# EAGLE design Gameboy-Link-Clock (EAGLE 9.5.2)
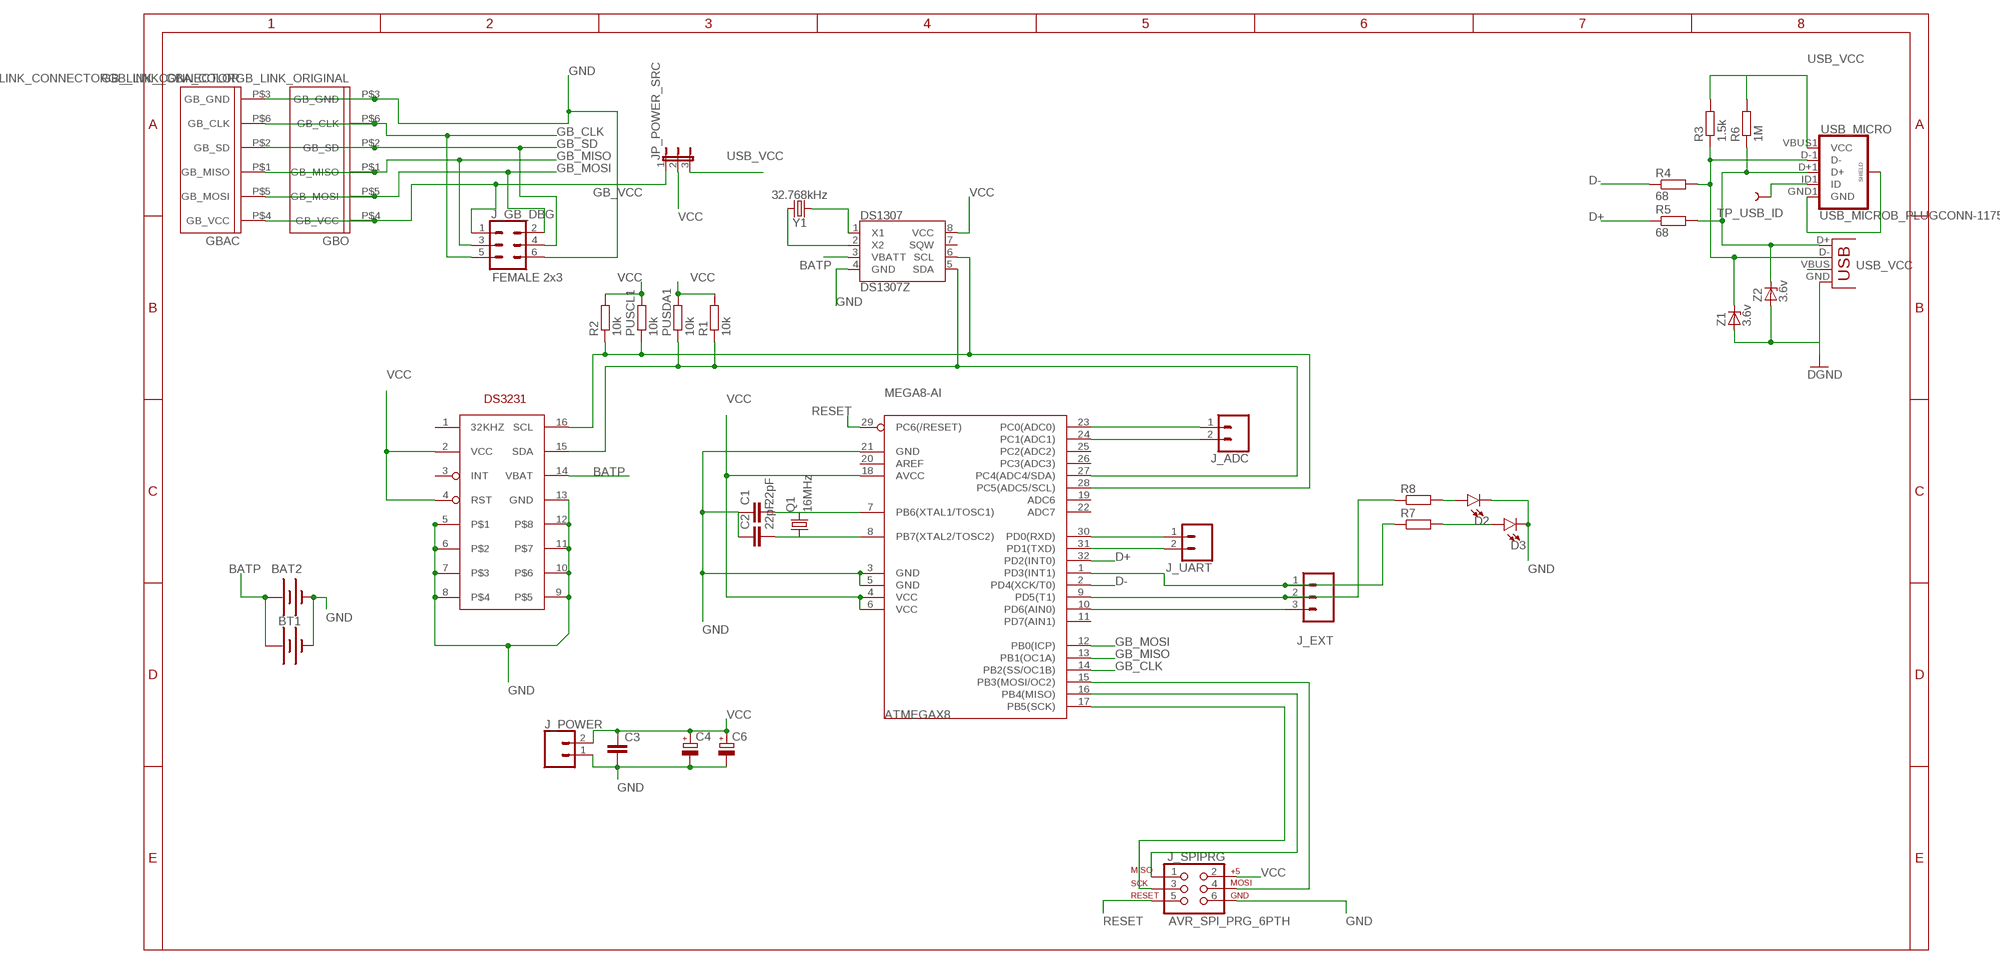
[diagram p0: schematic, sheet 1]

## Parts
ATMEGAX8  MEGA8-AI  [TQFP32-08]
BAT2  BATTERY-20MM_PTH  [BATTCOM_20MM_PTH]
BT1  BATTERY-20MM_SMD  [BATTCON_20MM]
C1  22pF  C-EU025-024X044  [C025-024X044]
C2  22pF  C-EU025-024X044  [C025-024X044]
C3  C-EU025-024X044  [C025-024X044]
C4  CPOL-EUE2,5-6E  [E2,5-6E]
C6  CPOL-EU150CLZ-1014  [150CLZ-1014]
D2  LED1206  [LED-1206]
D3  LED1206  [LED-1206]
DS1307  DS1307Z  [SO08-0.15]
DS3231  DS3231DS3231-SO16W  [SO16W]
GBAC  GB_LINK_CONNECTORGB_LINK_GBA_COLOR  [GB_LINK_CONNECTOR_COLOR]
GBO  GB_LINK_CONNECTORGB_LINK_ORIGINAL  [GB_LINK_CONNECTOR_CLASSIC]
J_ADC  CONN_02  [1X02]
J_EXT  455-1750-1-ND  CONN_03  [1X03]
J_GB_DBG  FEMALE 2x3  CONN_03X2FEMALE  [2X3]
J_POWER  CONN_02  [1X02]
J_SPIPRG  AVR_SPI_PRG_6PTH  [2X3]
J_UART  CONN_02  [1X02]
JP_POWER_SRC  JP2E  [JP2]
PUSCL1  10k  R-EU_0207/2V  [0207/2V]
PUSDA1  10k  R-EU_0207/2V  [0207/2V]
Q1  16MHz  CRYSTALHC49S  [HC49/S]
R1  10k  R-EU_R1206  [R1206]
R2  10k  R-EU_R1206  [R1206]
R3  1.5k  R-EU_0204/2V  [0204V]
R4  68  R-EU_0204/2V  [0204V]
R5  68  R-EU_0204/2V  [0204V]
R6  1M  R-EU_0204/2V  [0204V]
R7  R-EU_R1206  [R1206]
R8  R-EU_R1206  [R1206]
TP_USB_ID  TEST-POINT3X5  [PAD.03X.05]
USB_MICRO  USB_MICROB_PLUGCONN-11752  [USB-B-MICRO-SMD_V03]
USB_MINI  USBSMD  [USB-MINIB]
Y1  32.768kHz  CRYSTAL-32.768KHZPTH-2X6  [CRYSTAL-PTH-2X6-CYL]
Z1  3.6v  ZENER-DIODEZD-2.5  [ZDIO-2.5]
Z2  3.6v  ZENER-DIODEZD-2.5  [ZDIO-2.5]

## Nets
BATP: BAT2.1(+) BT1.1(+) DS1307.3(VBATT) DS3231.14(VBAT)
D+: ATMEGAX8.32(PD2(INT0)) R5.1
D-: ATMEGAX8.2(PD4(XCK/T0)) R4.1
GB_CLK: ATMEGAX8.14(PB2(SS/OC1B)) GBAC.P$6(GB_CLK) GBO.P$6(GB_CLK) J_GB_DBG.5
GB_MISO: ATMEGAX8.13(PB1(OC1A)) GBAC.P$1(GB_MISO) GBO.P$1(GB_MISO) J_GB_DBG.3
GB_MOSI: ATMEGAX8.12(PB0(ICP)) GBAC.P$5(GB_MOSI) GBO.P$5(GB_MOSI) J_GB_DBG.2
GB_SD: GBAC.P$2(GB_SD) GBO.P$2(GB_SD) J_GB_DBG.4
GB_VCC: GBAC.P$4(GB_VCC) GBO.P$4(GB_VCC) J_GB_DBG.1 JP_POWER_SRC.1
GND: ATMEGAX8.3(GND) ATMEGAX8.5(GND) ATMEGAX8.21(GND) BAT2.2(-) BT1.2(-) C1.1 C2.1 C3.2 C4.- C6.- D2.C D3.C DS1307.4(GND) DS3231.5 DS3231.6 DS3231.7 DS3231.8 DS3231.9 DS3231.10 DS3231.11 DS3231.12 DS3231.13(GND) GBAC.P$3(GB_GND) GBO.P$3(GB_GND) J_GB_DBG.6 J_POWER.1 J_SPIPRG.6 USB_MICRO.GND1(GND) USB_MICRO.SHIELD1(SHIELD) USB_MICRO.SHIELD2(SHIELD) USB_MICRO.SHIELD3(SHIELD) USB_MINI.GND Z1.A Z2.A ; supply symbol labelled DGND
N$1: ATMEGAX8.28(PC5(ADC5/SCL)) DS1307.6(SCL) DS3231.16(SCL) PUSCL1.1 R2.1
N$2: ATMEGAX8.27(PC4(ADC4/SDA)) DS1307.5(SDA) DS3231.15(SDA) PUSDA1.1 R1.1
N$3: ATMEGAX8.17(PB5(SCK)) J_SPIPRG.3
N$4: ATMEGAX8.7(PB6(XTAL1/TOSC1)) C1.2 Q1.2
N$5: ATMEGAX8.8(PB7(XTAL2/TOSC2)) C2.2 Q1.1
N$7: ATMEGAX8.15(PB3(MOSI/OC2)) J_SPIPRG.4
N$8: ATMEGAX8.16(PB4(MISO)) J_SPIPRG.1
N$9: ATMEGAX8.1(PD3(INT1)) J_EXT.1 R7.1
N$11: ATMEGAX8.10(PD6(AIN0)) J_EXT.3
N$12: ATMEGAX8.30(PD0(RXD)) J_UART.1
N$13: ATMEGAX8.31(PD1(TXD)) J_UART.2
N$14: TP_USB_ID.1 USB_MICRO.ID1(ID)
N$15: ATMEGAX8.24(PC1(ADC1)) J_ADC.2
N$17: ATMEGAX8.9(PD5(T1)) J_EXT.2 R8.1
N$18: ATMEGAX8.23(PC0(ADC0)) J_ADC.1
N$19: D2.A R8.2
N$20: D3.A R7.2
N$23: DS1307.1(X1) Y1.1
N$24: DS1307.2(X2) Y1.2
RESET: ATMEGAX8.29(PC6(/RESET)) J_SPIPRG.5
USB_VCC: JP_POWER_SRC.3 R3.2 R6.2 USB_MICRO.VBUS1(VCC) USB_MINI.VBUS
USBD+: R5.2 R6.1 USB_MICRO.D+1(D+) USB_MINI.D+ Z2.C
USBD-: R3.1 R4.2 USB_MICRO.D-1(D-) USB_MINI.D- Z1.C
VCC: ATMEGAX8.4(VCC) ATMEGAX8.6(VCC) ATMEGAX8.18(AVCC) C3.1 C4.+ C6.+ DS1307.8(VCC) DS3231.2(VCC) DS3231.4(RST) J_POWER.2 J_SPIPRG.2 JP_POWER_SRC.2 PUSCL1.2 PUSDA1.2 R1.2 R2.2
Unconnected: ATMEGAX8.11(PD7(AIN1)) ATMEGAX8.19(ADC6) ATMEGAX8.20(AREF) ATMEGAX8.22(ADC7) ATMEGAX8.25(PC2(ADC2)) ATMEGAX8.26(PC3(ADC3)) DS1307.7(SQW) DS3231.1(32KHZ) DS3231.3(INT)

## Library data of the parts
ATMEGAX8 = atmel:MEGA8: MICROCONTROLLER 8 Kbytes FLASH, 1 kbytes SRAM, 512 bytes EEPROM, USART, 6-channel 10 bit ADC, 2-channel 8 bit ADC Pin compatible with Atmega48, ATMega88, ATMega168 Source: avr.lbr; MPN: ATMEGA8-16AU; OC_FARNELL: 9171371; OC_NEWARK: 73M8863
BAT2 = SparkFun-Batteries:BATTERY: Battery - Single Cell A variety of battery chemistries, sizes, and footprints. Device List: 20MM_PTH - Coin Cell Battery Holder - 20mm (PTH) <https://www.sparkfun.com/products/783> 20MM_PTH_KIT- Coin Cell battery Holder - 20 mm (PTH) <http://www.sparkfun.com/products/783>kit version with special mask 6.8MM_PTH - Coin Cell Battery Holder - 6.8MM(SMD) <https://www.digikey.com/product-detail/en/seiko-instruments/MS621FE-FL11E/728-1057-ND/1889208?WT.srch=1&gclid=CNOQ5a6LzdQCFZS2wAodXCkE0g> 12MM_SMD - Coin Cell Battery Holder - 12mm (SMD) <https://www.sparkfun.com/products/10592> 12MM_PTH - Coin Cell Battery Holder - 12mm (PTH) <https://www.sparkfun.com/products/7948> 20MM_SMD - 20mm Coin Cell Battery Holder (SMD) (2 legs) Used on the Big Time Watch Kit <https://www.sparkfun.com/products/11734> 20MM_SMD_4LEGS - Coin Cell Battery Holder - 20mm (SMD) <https://www.sparkfun.com/products/11892> 20MM_SMD_4LEGS_OVERPASTE - Coin Cell Battery Holder - 20mm (SMD) <https://www.sparkfun.com/products/11892> (Over-paste on the legs) 24.5MM_PTH - Coin Cell Battery Holder - 24.5mm (PTH) <https://www.sparkfun.com/products/8863> 9V - 9V Battery Holder - PC Mount Used on the SparkFun SparkPunk Sound Kit <https://www.sparkfun.com/products/11177> and SparkFun SparkPunk Sequencer Kit <https://www.sparkfun.com/products/12707> 18650 - Battery Holder - 18650 (PTH) <https://www.sparkfun.com/products/13113> AA - Battery Holder - 1xAA (PTH) <https://www.sparkfun.com/products/7949> AAA - Battery Holder - 1xAAA (PTH) <https://www.sparkfun.com/products/12718> AA_KIT - Battery Holder - 1xAA (PTH) <https://www.sparkfun.com/products/7949> Special kit package - pads only have exposed copper on one side of the board. AAA_KIT - Battery Holder - 1xAAA (PTH) <https://www.sparkfun.com/products/12718> Special kit package - pads only have exposed copper on one side of the board.; PROD_ID: BATT-09031; SF_SKU: PRT-00783
BT1 = SparkFun-Batteries:BATTERY: Battery - Single Cell A variety of battery chemistries, sizes, and footprints. Device List: 20MM_PTH - Coin Cell Battery Holder - 20mm (PTH) <https://www.sparkfun.com/products/783> 20MM_PTH_KIT- Coin Cell battery Holder - 20 mm (PTH) <http://www.sparkfun.com/products/783>kit version with special mask 6.8MM_PTH - Coin Cell Battery Holder - 6.8MM(SMD) <https://www.digikey.com/product-detail/en/seiko-instruments/MS621FE-FL11E/728-1057-ND/1889208?WT.srch=1&gclid=CNOQ5a6LzdQCFZS2wAodXCkE0g> 12MM_SMD - Coin Cell Battery Holder - 12mm (SMD) <https://www.sparkfun.com/products/10592> 12MM_PTH - Coin Cell Battery Holder - 12mm (PTH) <https://www.sparkfun.com/products/7948> 20MM_SMD - 20mm Coin Cell Battery Holder (SMD) (2 legs) Used on the Big Time Watch Kit <https://www.sparkfun.com/products/11734> 20MM_SMD_4LEGS - Coin Cell Battery Holder - 20mm (SMD) <https://www.sparkfun.com/products/11892> 20MM_SMD_4LEGS_OVERPASTE - Coin Cell Battery Holder - 20mm (SMD) <https://www.sparkfun.com/products/11892> (Over-paste on the legs) 24.5MM_PTH - Coin Cell Battery Holder - 24.5mm (PTH) <https://www.sparkfun.com/products/8863> 9V - 9V Battery Holder - PC Mount Used on the SparkFun SparkPunk Sound Kit <https://www.sparkfun.com/products/11177> and SparkFun SparkPunk Sequencer Kit <https://www.sparkfun.com/products/12707> 18650 - Battery Holder - 18650 (PTH) <https://www.sparkfun.com/products/13113> AA - Battery Holder - 1xAA (PTH) <https://www.sparkfun.com/products/7949> AAA - Battery Holder - 1xAAA (PTH) <https://www.sparkfun.com/products/12718> AA_KIT - Battery Holder - 1xAA (PTH) <https://www.sparkfun.com/products/7949> Special kit package - pads only have exposed copper on one side of the board. AAA_KIT - Battery Holder - 1xAAA (PTH) <https://www.sparkfun.com/products/12718> Special kit package - pads only have exposed copper on one side of the board.; PROD_ID: BATT-11519
C1 C2 = resistor:C-EU: CAPACITOR, European symbol
C3 = rcl:C-EU: CAPACITOR, European symbol; SPICEPREFIX: C
C4 C6 = rcl:CPOL-EU: POLARIZED CAPACITOR, European symbol; SPICEPREFIX: C
D2 D3 = SparkFun-LED:LED: LED (Generic) Standard schematic elements and footprints for 5mm, 3mm, 1206, and 0603 sized LEDs. Generic LEDs with no color specified.
DS1307 = SparkFun-Clocks:DS1307: Maxim DS1307 - I2C Real-time clock (RTC) The DS1307 serial real-time clock (RTC) is a low-power, full binary-coded decimal (BCD) clock/calendar plus 56 bytes of NV SRAM. Address and data are transferred serially through an I2C, bidirectional bus. The clock/calendar provides seconds, minutes, hours, day, date, month, and year information. SparkFun Products: Real Time Clock Module <https://www.sparkfun.com/products/12708> (BOB-12708) Datasheet <https://cdn.sparkfun.com/datasheets/BreakoutBoards/DS1307.pdf>; PROD_ID: IC-08138
DS3231 = kalshagar:DS3231: DS3231 with a WIDE package SO16W. About 1cm x 1cm.
GBAC GBO = kalshagar:GB_LINK_CONNECTOR: Gameboy Link connector (male), to be used with cables. (not direct connect since GB has male connector too)
J_ADC J_POWER J_UART = SparkFun-Connectors:CONN_02: Multi connection point. Often used as Generic Header-pin footprint for 0.1 inch spaced/style header connections On any of the 0.1 inch spaced packages, you can populate with these: Break Away Headers - Straight <https://www.sparkfun.com/products/116> (PRT-00116) Break Away Male Headers - Right Angle <https://www.sparkfun.com/products/553> (PRT-00553) Female Headers <https://www.sparkfun.com/products/115> (PRT-00115) Break Away Headers - Machine Pin <https://www.sparkfun.com/products/117> (PRT-00117) Break Away Female Headers - Swiss Machine Pin <https://www.sparkfun.com/products/743> (PRT-00743) For SCREWTERMINALS and SPRING TERMINALS visit here: Screw Terimnals on SparkFun.com <https://www.sparkfun.com/search/results?term=Screw+Terminals> (5mm/3.5mm/2.54mm spacing) This device is also useful as a general connection point to wire up your design to another part of your project. Our various solder wires solder well into these plated through hole pads. Hook-Up Wire - Assortment (Stranded, 22 AWG) <https://www.sparkfun.com/products/11375> (PRT-11375) Hook-Up Wire - Assortment (Solid Core, 22 AWG) <https://www.sparkfun.com/products/11367> (PRT-11367) View the entire wire category on our website here <https://www.sparkfun.com/categories/141> Special notes: Molex polarized connector foot print use with: PRT-08233 with associated crimp pins and housings. 2.54_SCREWTERM for use with PRT-10571. 3.5mm Screw Terminal footprints for PRT-08084 5mm Screw Terminal footprints for use with PRT-08432
J_EXT = SparkFun-Connectors:CONN_03: Multi connection point. Often used as Generic Header-pin footprint for 0.1 inch spaced/style header connections On any of the 0.1 inch spaced packages, you can populate with these: Break Away Headers - Straight <https://www.sparkfun.com/products/116> (PRT-00116) Break Away Male Headers - Right Angle <https://www.sparkfun.com/products/553> (PRT-00553) Female Headers <https://www.sparkfun.com/products/115> (PRT-00115) Break Away Headers - Machine Pin <https://www.sparkfun.com/products/117> (PRT-00117) Break Away Female Headers - Swiss Machine Pin <https://www.sparkfun.com/products/743> (PRT-00743) Stackable Header - 3 Pin (Female, 0.1") <https://www.sparkfun.com/products/13875> (PRT-13875) For SCREWTERMINALS and SPRING TERMINALS visit here: Screw Terimnals on SparkFun.com <https://www.sparkfun.com/search/results?term=Screw+Terminals> (5mm/3.5mm/2.54mm spacing) This device is also useful as a general connection point to wire up your design to another part of your project. Our various solder wires solder well into these plated through hole pads. Hook-Up Wire - Assortment (Stranded, 22 AWG) <https://www.sparkfun.com/products/11375> (PRT-11375) Hook-Up Wire - Assortment (Solid Core, 22 AWG) <https://www.sparkfun.com/products/11367> (PRT-11367) View the entire wire category on our website here <https://www.sparkfun.com/categories/141> Special notes: Molex polarized connector foot print use with SKU : PRT-08232 with associated crimp pins and housings.; PROD_ID: XXX-00000
J_GB_DBG = SparkFun-Connectors:CONN_03X2: Multi connection point. Often used as Generic Header-pin footprint for 0.1 inch spaced/style header connections You can populate with any combo of single row headers, but if you'd like an exact match, check these: Header - 2x3 (Male, 0.1") <https://www.sparkfun.com/products/12807> (PRT-12807) Header - 2x3 (Female, 0.1") <https://www.sparkfun.com/products/13010> (PRT-13010) 2x3 Pin Shrouded Header <https://www.sparkfun.com/products/10877> (PRT-10877) On any of the 0.1 inch spaced packages, you can populate with these: Break Away Headers - Straight <https://www.sparkfun.com/products/116> (PRT-00116) Break Away Male Headers - Right Angle <https://www.sparkfun.com/products/553> (PRT-00553) Female Headers <https://www.sparkfun.com/products/115> (PRT-00115) Break Away Headers - Machine Pin <https://www.sparkfun.com/products/117> (PRT-00117) Break Away Female Headers - Swiss Machine Pin <https://www.sparkfun.com/products/743> (PRT-00743) Special note: the shrouded connector mates well with our 3x2 ribbon cables: Ribbon Crimp Connector - 6-pin (2x3, Female) <https://www.sparkfun.com/products/10651> (PRT-10651) Ribbon Cable - 6 wire (15ft) <https://www.sparkfun.com/products/10646> (PRT-10646); PROD_ID: CONN-11566
J_SPIPRG = SparkFun:AVR_SPI_PRG_6: AVR ISP 6 Pin This is the reduced ISP connector for AVR programming. Common on Arduino. This footprint will take up less PCB space and can be used with a 10-pin to 6-pin adapter such as SKU: BOB-08508
JP_POWER_SRC = jumper:JP2E: JUMPER
PUSCL1 PUSDA1 R1 R2 R7 R8 = rcl:R-EU_: RESISTOR, European symbol; SPICEPREFIX: R
Q1 = crystal:CRYSTAL: CRYSTAL; OC_FARNELL: 1667008; OC_NEWARK: unknown
R3-R6 = resistor:R-EU_: RESISTOR, European symbol
TP_USB_ID = SparkFun-Connectors:TEST-POINT: SparkFun Test Points Bare copper test points for troubleshooting or In-Circuit-Testing. These are used by our Production team for verifying production board runs using pogo-pins on test beds. SparkFun Products: SparkFun LSM9DS1 Breakout <https://www.sparkfun.com/products/13284> SparkFun PSOC <https://www.sparkfun.com/products/13714> SparkFun Load Cell Amplifier <https://www.sparkfun.com/products/13879>
USB_MICRO = SparkFun-Connectors:USB_MICROB_PLUG: USB Micro-B connectors Some male, some female. Watch your step!; PROD_ID: CONN-11752
USB_MINI = SparkFun-Connectors:USB: USB Connectors USB-B-PTH is fully proven SKU : PRT-00139/CONN-08278 USB-miniB is fully proven SKU : PRT-00587 USB-A-PCB is untested. USB-A-H is throughly reviewed, but untested. Spark Fun Electronics SKU : PRT-00437 USB-B-SMT is throughly reviewed, but untested. Needs silkscreen touching up. USB-A-S has not been used/tested USB-MB-H has not been used/tested USB-MICROB has been used. CONN-09505; PROD_ID: CONN-08193
Y1 = SparkFun-Clocks:CRYSTAL-32.768KHZ: 32.768kHz Crystal Frequency: 32.768kHz Frequency Stability: ±20ppm Load Capacitance: 12.5pF (PTH-2X6 & SMD-3.2X1.5), 6pF (SMD-2X6) SparkFun Products: SparkFun BigTime Watch Kit <https://www.sparkfun.com/products/11734> SparkFun nRF52832 Breakout <https://www.sparkfun.com/products/13990> SparkFun Real Time Clock Module <https://www.sparkfun.com/products/12708>; PROD_ID: XTAL-10112
Z1 Z2 = diode:ZENER-DIODE: Z-Diode

## Board
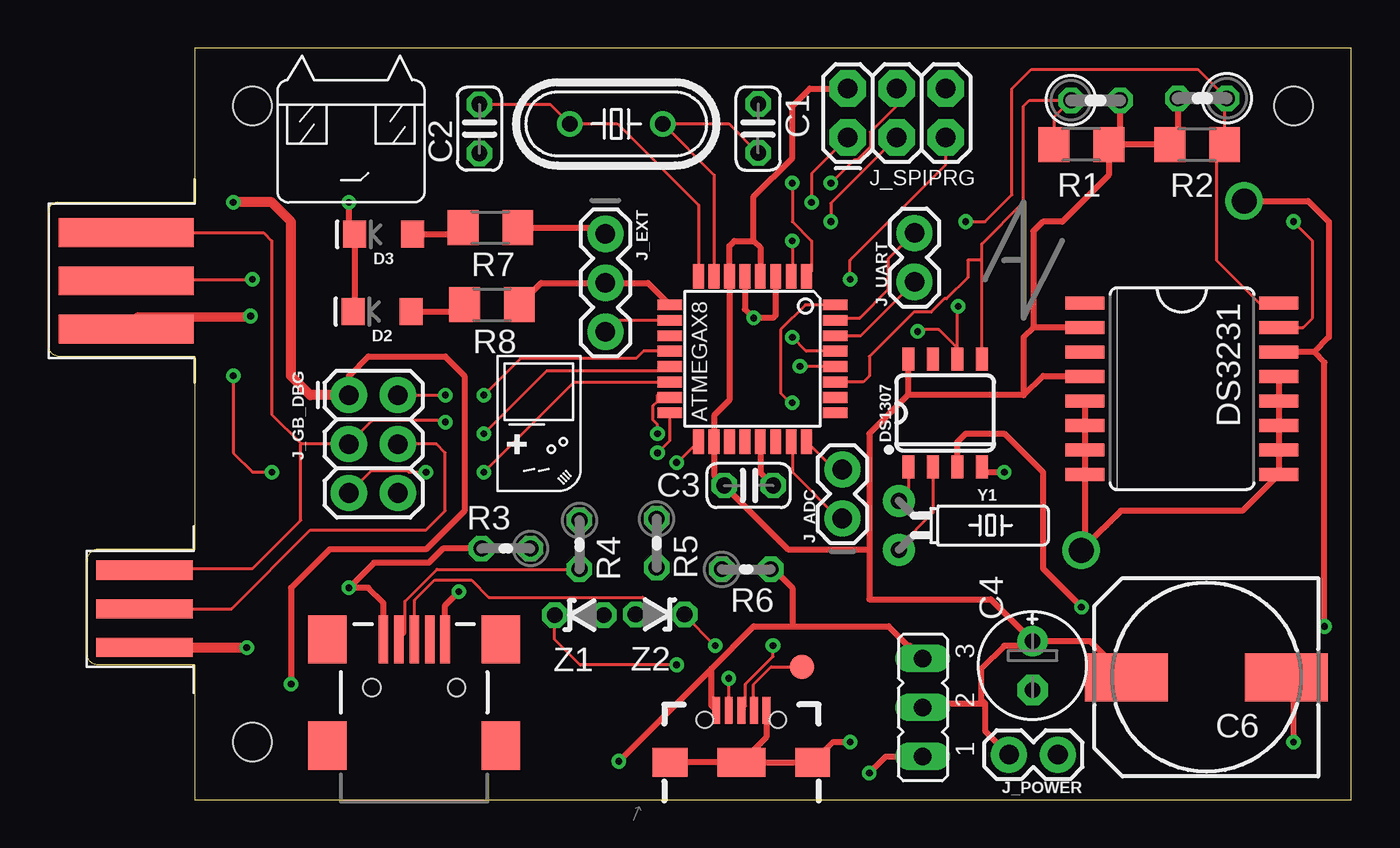
[diagram p1: board, top side]
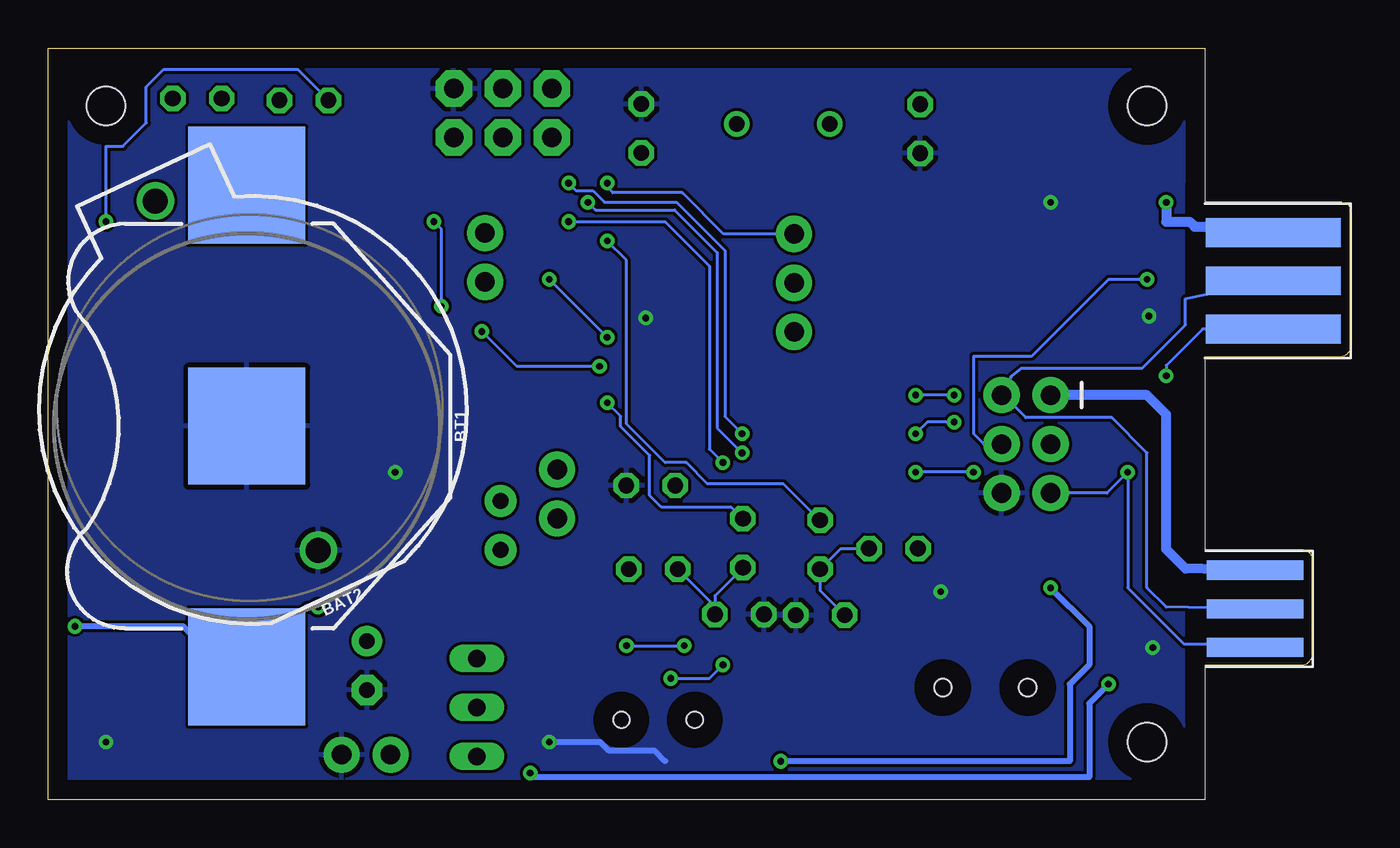
[diagram p2: board, bottom side, seen from below]

Size 67.6 x 39 mm. Coordinates in mm from the lower left corner, seen from the top.
Outline: 7.6,0 67.6,0 67.6,39 7.6,39 7.6,31 0.5,31 arc90 0,30.5 0,23.6 arc90 0.6,23 7.6,23 7.6,13 2.6,13 arc90 2,12.4 2,7.6 arc90 2.6,7 7.6,7 7.6,0
Copper layers (1*16): Top 0.035mm / dielectric 1.5mm / Bottom 0.035mm
Design rules "default": minimum track width 6mil, minimum drill 0.35mm, track to track 6mil, track to pad 6mil, pad to pad 6mil, via to via 6mil, smd to smd 6mil, copper to edge 40mil, drill to drill 6mil, minimum pad ring 10mil, minimum via ring 8mil, stop-mask expansion 4mil, vias tented up to drill 0mil, thermal gap 10mil
Holes 2 mm at 10.6,36 64.6,36 10.6,3

### Footprints (pad centres in the part's own frame; a part is rotated, then mirrored left to right if it is on the bottom)
TQFP32-08 = smd 1.27 x 0.559: 1 -4.293,2.8; 2 -4.293,2; 3 -4.293,1.2; 4 -4.293,0.4; 5 -4.293,-0.4; 6 -4.293,-1.2; 7 -4.293,-2; 8 -4.293,-2.8; 17 4.293,-2.8; 18 4.293,-2; 19 4.293,-1.2; 20 4.293,-0.4; 21 4.293,0.4; 22 4.293,1.2; 23 4.293,2; 24 4.293,2.8 | smd 0.559 x 1.27: 9 -2.8,-4.293; 10 -2,-4.293; 11 -1.2,-4.293; 12 -0.4,-4.293; 13 0.4,-4.293; 14 1.2,-4.293; 15 2,-4.293; 16 2.8,-4.293; 25 2.8,4.293; 26 2,4.293; 27 1.2,4.293; 28 0.4,4.293; 29 -0.4,4.293; 30 -1.2,4.293; 31 -2,4.293; 32 -2.8,4.293
BATTCOM_20MM_PTH = drill 1.3: 1 11.85,0; 2 -8.15,0
BATTCON_20MM = smd 6.07 x 6.07: 1 -12.5,0; 2 0,0; 3 12.5,0
C025-024X044 = drill 0.813 octagon: 1 -1.27,0; 2 1.27,0
E2,5-6E = drill 0.813 pad 1.575: + -1.27,0 | drill 0.813 pad 1.575 octagon: - 1.27,0
150CLZ-1014 = smd 4.3 x 2.5: + 4.15,0; - -4.15,0
LED-1206 = smd 1.2 x 1.4: A -1.5,0; C 1.5,0
SO08-0.15 = smd 0.6 x 1.2: 1 -1.905,-2.8; 2 -0.635,-2.8; 3 0.635,-2.8; 4 1.905,-2.8; 5 1.905,2.8; 6 0.635,2.8; 7 -0.635,2.8; 8 -1.905,2.8
SO16W = smd 0.66 x 2.032: 1 -5.715,-5.029; 2 -4.445,-5.029; 3 -3.175,-5.029; 4 -1.905,-5.029; 5 -0.635,-5.029; 6 0.635,-5.029; 7 1.905,-5.029; 8 3.175,-5.029; 9 3.175,5.029; 10 1.905,5.029; 11 0.635,5.029; 12 -0.635,5.029; 13 -1.905,5.029; 14 -3.175,5.029; 15 -4.445,5.029; 16 -5.715,5.029
GB_LINK_CONNECTOR_COLOR = smd 1 x 5: P$1 1,0; P$2 3,0; P$3 5,0 | smd 1 x 5 bottom: P$4 1,0; P$5 3,0; P$6 5,0
GB_LINK_CONNECTOR_CLASSIC = smd 1.5 x 7: P$1 1.5,1; P$2 4,1; P$3 6.5,1 | smd 1.5 x 7 bottom: P$4 1.5,1; P$5 4,1; P$6 6.5,1
1X02 = drill 1.016 pad 1.88: 1 0,0; 2 2.54,0
1X03 = drill 1.016 pad 1.88: 1 0,0; 2 2.54,0; 3 5.08,0
2X3 = drill 1.016 pad 1.88: 1 0,0; 2 0,2.54; 3 2.54,0; 4 2.54,2.54; 5 5.08,0; 6 5.08,2.54
2X3' = drill 1.016 pad 1.88 octagon: 1 0,0; 2 0,2.54; 3 2.54,0; 4 2.54,2.54; 5 5.08,0; 6 5.08,2.54
JP2 = drill 0.914 long: 1 -2.54,0; 2 0,0; 3 2.54,0
0207/2V = drill 0.813 octagon: 1 -1.27,0; 2 1.27,0
HC49/S = drill 0.813: 1 -2.413,0; 2 2.413,0
R1206 = smd 1.6 x 1.803: 1 -1.422,0; 2 1.422,0
0204V = drill 0.813 octagon: 1 -1.27,0; 2 1.27,0
PAD.03X.05 = smd 1.27 x 1.27: 1 0,0
USB-B-MICRO-SMD_V03 = smd 1.4 x 0.4: D+1 2.7,0; D-1 2.7,0.65; GND1 2.7,-1.3; ID1 2.7,-0.65; VBUS1 2.7,1.3 | smd 1.5 x 1.8: SHIELD1 0,3.7; SHIELD2 0,-3.7 | smd 1.5 x 2.5: SHIELD3 0,0 | hole 0.85: 2.2,1.9; 2.2,-1.9
USB-MINIB = smd 2.5 x 0.5: D+ 2.5,0; D- 2.5,0.8; GND 2.5,-1.6; ID 2.5,-0.8; VBUS 2.5,1.6 | smd 2.5 x 2: MTN1 -3,4.5; MTN2 2.5,4.5; MTN3 -3,-4.5; MTN4 2.5,-4.5 | hole 0.9: 0,2.2; 0,-2.2
CRYSTAL-PTH-2X6-CYL = drill 0.813 pad 1.676: 1 -1.27,0; 2 1.27,0
ZDIO-2.5 = drill 0.813 octagon: A 1.27,0; C -1.27,0

### Placement (x,y rotation side)
ATMEGAX8  36.54,22.88 270 top
BAT2  57.03,20.33 115 bottom
BT1  57.3,19.39 90 bottom
C1  36.83,34.83 270 top
C2  22.37,34.82 90 top
C3  36.34,16.31 0 top
C4  51.06,6.97 270 top
C6  60.08,6.36 180 top
D2  17.32,25.34 180 top
D3  17.4,29.34 180 top
DS1307  46.53,20.07 0 top
DS3231  58.81,20.06 270 top
GBAC  5,12.91 270 top
GBO  3.04,30.93 270 top
J_ADC  41.2,14.6 90 top
J_EXT  28.91,29.36 270 top
J_GB_DBG  15.6,21 270 top
J_POWER  52.38,2.34 180 top
J_SPIPRG  AVR_SPI_PRG_6PTH  [2X3']  41.48,34.37 0 top
J_UART  44.94,26.87 90 top
JP_POWER_SRC  45.37,4.79 90 top
PUSCL1  59.87,36.4 180 top
PUSDA1  54.33,36.3 0 top
Q1  29.47,35.07 0 top
R1  53.6,34 0 top
R2  59.6,34 180 top
R3  23.75,13.04 180 top
R4  27.56,13.23 270 top
R5  31.56,13.31 270 top
R6  36.21,11.96 0 top
R7  22.94,29.69 180 top
R8  23.02,25.69 180 top
TP_USB_ID  39.1,6.9 0 top
U$1  [PIGMAN1]  11.9,31 0 top
U$2  [GB]  23.3,15.4 0 top
USB_MICRO  35.96,1.95 90 top
USB_MINI  18.99,5.82 90 top
Y1  44.13,14.24 270 top
Z1  27.55,9.58 0 top
Z2  31.74,9.62 180 top

### Tracks (layer width: path | path; a pad name or v marks a point on that pad's centre or on a via)
BATP  (via drill 0.35)
  Top 0.305: BAT2.1 65.36,31.07 66.43,30 66.43,24 65.67,23.23 | 65.67,23.23 DS3231.14 | v66.21,9 66.21,22.7 65.67,23.23 | DS1307.3 47.16,18.57 47.6,19 49.6,19 51.6,17 51.6,12 v53.6,10
  Bottom 0.305: 66.43,9 v66.21,9 60.6,9 58.49,6.89 BT1.1 54.19,10 v53.6,10
D+  (via drill 0.35)
  Top 0.152: ATMEGAX8.32 39.28,25.68 38,24.4 38,21.1 38.4,20.7 38.6,20.7 v38.6,20.6
  Bottom 0.152: R5.1 32.18,15.2 35.8,15.2 36.4,15.8 36.4,17.87 37.91,19.37 37.91,19.91 v38.6,20.6
D-  (via drill 0.35)
  Top 0.152: v38.6,29 38.6,27.23 ATMEGAX8.2
  Bottom 0.152: R4.1 29.46,16.4 33.4,16.4 34.5,17.5 35.6,17.5 37.6,19.5 37.6,28 v38.6,29
GB_CLK  (via drill 0.35)
  Top 0.152: v9.6,22 9.6,18 10.6,17 v11.6,17 | v19.6,17 18.71,17 18.62,17.09 16.77,17.09 J_GB_DBG.5 | v22.6,17 27.28,21.68 ATMEGAX8.14
  Bottom 0.152: GBO.P$6 7.71,24.43 9.6,22.55 v9.6,22 | J_GB_DBG.5 12.68,15.92 v11.6,17 11.6,11 8.69,8.09 6.6,8.09 5.18,8.09 | 5.18,8.09 4.6,8.09 | v19.6,17 v22.6,17 | GBAC.P$6 5.18,8.09
GB_MISO  (via drill 0.35)
  Top 0.152: GBO.P$1 11.17,29.43 11.6,29 11.6,20 13.14,18.46 | 13.14,18.46 J_GB_DBG.3 16.84,19.7 20.6,19.7 v20.6,19.6 | GBAC.P$1 5.09,12 10.6,12 13.1,14.5 13.1,18.46 13.14,18.46 | 32.15,22.58 ATMEGAX8.13 32.04,22.27 25.87,22.27 v22.6,19
  Bottom 0.152: v20.6,19.6 22,19.6 v22.6,19
GB_MOSI  (via drill 0.35)
  Top 0.152: J_GB_DBG.2 v20.6,21 | v22.6,21 24.5,22.9 30.5,22.9 30.88,23.28 ATMEGAX8.12
  Bottom 0.152: GBAC.P$5 9.6,10 10.6,11 10.6,18 12.43,19.83 16.88,19.83 18.05,21 J_GB_DBG.2 17.6,22 17.1,22.4 10.85,22.4 8.6,24.64 8.6,26 GBO.P$5 | v20.6,21 v22.6,21
GB_SD  (via drill 0.35)
  Top 0.152: GBO.P$2 4.11,27 v10.6,27 | GBAC.P$2 9.51,9.91 13.6,14 19.6,14 20.6,15 20.6,18 20.14,18.46 J_GB_DBG.4
  Bottom 0.152: v10.6,27 12.6,27 16.6,23 19.6,23 19.6,19 19.06,18.46 J_GB_DBG.4
GB_VCC  (via drill 0.35)
  Top 0.305: J_GB_DBG.1 15.6,22 16.6,23 20.6,23 21.6,22 21.6,15 19.6,13 14.6,13 12.6,11 v12.6,6 | v42.6,1.39 43.46,2.25 JP_POWER_SRC.1
  Top 0.508: J_GB_DBG.1 13.6,21 12.6,22 12.6,30 11.6,31 v9.6,31
  Bottom 0.305: v12.6,6 13.6,5 13.6,1.17 42.6,1.17 v42.6,1.39
  Bottom 0.508: GBAC.P$4 8.6,12 9.6,13 9.6,20 10.6,21 J_GB_DBG.1 | v9.6,31 9.6,30 8.4,30 8.13,29.73 4.34,29.73 GBO.P$4
GND  (via drill 0.35)
  Top 0.305: ATMEGAX8.21 36.94,16.98 C3.2 | USB_MINI.GND 20.59,10.09 v21.3,10.8 | USB_MICRO.GND1 37.26,3.25 USB_MICRO.SHIELD3 | USB_MICRO.SHIELD3 USB_MICRO.SHIELD1 | USB_MICRO.SHIELD3 USB_MICRO.SHIELD2 40.71,3 v41.6,3 | C6.- 64.6,5.99 v64.6,3 | DS3231.5 DS3231.6 DS3231.7 DS3231.8 53.78,13.14 | 53.78,13.14 BAT2.2 | DS1307.4 48.7,17 v49.6,17 | DS3231.13 DS3231.12 DS3231.11 DS3231.10 DS3231.9 61.95,15 55.64,15 53.78,13.14 | ATMEGAX8.5 36.14,25.46 v36.6,25 37.6,25 37.74,25.14 ATMEGAX8.3 | D2.C 15.9,25.42 D3.C 15.6,29.64 v15.6,31
  Top 0.508: v10.5,25.1 10.41,25.01 4.65,25.05 GBO.P$3 | GBAC.P$3 6.6,7.91 v10.3,7.91 v10.3,7.9
  Bottom 0.305: v41.6,3 38.96,3 38.52,2.56 36.16,2.56 35.6,2
  pour Bottom: 7.6,40 67.6,40 68.6,39 68.6,1 66.6,-1 8.6,-1 7.6,0 7.6,1
  cutout Bottom: 6.6,32 8.6,32 8.6,4 6.6,4
N$1  (via drill 0.35)
  Top 0.152: v45.1,24.3 45.2,24.4 46.2,24.4 47.16,23.43 DS1307.6 47.16,25.43 47.1,25.5 v47.2,25.6 | v39,22.5 40.81,22.5 ATMEGAX8.28 | DS3231.16 62.82,25.77 60.6,28 60.6,33.58 R2.1 61.02,36.28 PUSCL1.1 59.63,37.91 51.01,37.91 50,36.9 50,31.4 48.6,30 v47.6,30
  Bottom 0.152: v45.1,24.3 43.3,22.5 v39,22.5 | v47.2,25.6 47.2,29.6 v47.6,30
N$2  (via drill 0.35)
  Top 0.152: ATMEGAX8.27 42.28,21.68 42.6,22 42.6,23 44.9,25.3 45.8,25.3 46.5,26 46.6,26 47.7,27.1 47.7,28 48.44,28 DS1307.5 48.44,28.84 50.6,31 50.6,36 50.9,36.3 PUSDA1.1 52.18,35.42 R1.1 | DS3231.15 65.1,24.5 65.6,25 65.6,29 v64.6,30
  Bottom 0.152: v64.6,30 64.6,33.91 63.73,33.91 62.51,35.13 62.51,37 61.6,37.91 54.67,37.91 PUSDA1.1
N$3  (via drill 0.35)
  Top 0.152: J_SPIPRG.3 40.6,30.95 v40.6,30 | v32.6,17.5 32.65,17.5 ATMEGAX8.17
  Bottom 0.152: v40.6,30 35.6,30 33.3,27.7 33.3,18.2 v32.6,17.5
N$4
  Top 0.152: C1.2 35.32,35.07 Q1.2 34.54,32.41 ATMEGAX8.7
N$5
  Top 0.152: C2.2 26.04,36.09 Q1.1 29.53,35.07 33.74,30.86 ATMEGAX8.8
N$7  (via drill 0.35)
  Top 0.152: v40.6,32 41.8,33.2 41.96,33.2 42.65,33.89 42.65,34.65 44.02,36.02 J_SPIPRG.4 | v31.61,19 31.61,19.48 31.38,19.71 31.38,20.45 31.6,20.67 31.6,21 32.13,21 ATMEGAX8.15
  Bottom 0.152: v40.6,32 40.21,31.61 39.35,31.61 38.74,31 35,31 32.5,28.5 32.5,19.89 v31.61,19
N$8  (via drill 0.35)
  Top 0.152: J_SPIPRG.1 39.6,32.49 v39.6,31 | v31.61,18 32.25,18.64 ATMEGAX8.16
  Bottom 0.152: v39.6,31 39.2,30.6 35.1,30.6 32.9,28.4 32.9,19.3 v31.6,18 v31.61,18
N$9  (via drill 0.35)
  Top 0.152: v38.6,32 38.6,30 39.6,29 39.6,27.43 ATMEGAX8.1
  Top 0.305: R7.1 28.58,29.69 J_EXT.1
  Bottom 0.152: J_EXT.1 32.56,29.36 34.7,31.5 38.3,31.5 38.6,31.8 v38.6,32
N$11
  Top 0.152: J_EXT.3 29.51,24.88 ATMEGAX8.10
N$12
  Top 0.152: ATMEGAX8.30 42.15,24.08 J_UART.1
N$13
  Top 0.152: ATMEGAX8.31 40.95,25 42.1,25 43.6,26.5 43.6,28.07 J_UART.2
N$14
  Top 0.152: USB_MICRO.ID1 36.6,6 37.5,6.9 TP_USB_ID.1
N$15
  Top 0.152: ATMEGAX8.24 40.79,17.14 J_ADC.2
N$17
  Top 0.305: R8.1 25.57,26.82 J_EXT.2 31.11,26.82 ATMEGAX8.9
N$18
  Top 0.152: ATMEGAX8.23 38.6,18.53 38.6,17 41,14.6 J_ADC.1
N$19
  Top 0.305: D2.A 21.25,25.34 R8.2
N$20
  Top 0.305: D3.A 21.17,29.34 R7.2
N$23
  Top 0.152: DS1307.1 44.62,15.51 Y1.1
N$24
  Top 0.152: DS1307.2 45.9,14.9 44.13,13.13 Y1.2
RESET  (via drill 0.35)
  Top 0.152: ATMEGAX8.29 39.32,23.28 v38.6,24 v38.61,24 | v41.6,27 41.6,28 46.56,32.96 J_SPIPRG.5
  Bottom 0.152: v38.61,24 v41.6,26.99 v41.6,27
USB_VCC  (via drill 0.35)
  Top 0.305: USB_MICRO.VBUS1 34.4,4.91 34.4,6.8 | 34.4,6.8 36.6,9 38.6,9 | 38.6,9 43.6,9 44.6,8 44.7,8 JP_POWER_SRC.3 | USB_MINI.VBUS 17.39,10.21 16.6,11 v15.6,11 16.9,12.3 19.74,12.3 20.48,13.04 R3.2 | v29.6,2 34.4,6.8 | R6.2 37.64,11.96 38.6,11 38.6,9
  Bottom 0.305: v15.6,11 13.6,9 13.6,7 14.6,6 14.6,2 v29.6,2
USBD+  (via drill 0.35)
  Top 0.152: USB_MICRO.D+1 36.18,4.87 36.18,6.01 37.6,7.43 v37.6,8 | v34.6,8 33.01,9.59 Z2.C 31.73,9.62 30.84,10.51 22.85,10.51 21.95,11.41 20.05,11.41 19.01,10.37 19.01,8.34 USB_MINI.D+
  Bottom 0.152: v37.6,8 v34.6,8 | R5.2 33.01,10.59 Z2.C 33.01,10.03 R6.1
USBD-  (via drill 0.35)
  Top 0.152: USB_MICRO.D-1 v35.31,6.29 v35.3,6.3 | USB_MINI.D- 18.51,8.64 18.51,10.3 20.17,11.96 R4.2 | v32.6,7 27.6,7 26.28,8.32 Z1.C
  Bottom 0.152: v35.3,6.3 33.3,6.3 v32.6,7 | R3.1 26.48,13.04 R4.2 27.56,10.86 Z1.C
VCC
  Top 0.305: J_POWER.2 48.6,3.58 48.6,5 | 48.6,5 48.39,5.21 48.39,6.79 49.6,8 50.82,8 C4.+ | C4.+ 54.05,8.24 C6.+ | JP_POWER_SRC.2 45.58,5 48.6,5 | 42.6,13 38.38,13 C3.1 34.54,16.84 ATMEGAX8.18 34.54,19.94 35.34,20.74 ATMEGAX8.6 35.34,28.74 35.6,29 36.6,29 | 42.6,13 42.6,10.4 48.9,10.4 C4.+ | 36.6,29 36.94,28.66 ATMEGAX8.4 | 36.6,29 36.6,31.3 38.6,33.3 38.6,36 39.51,36.91 J_SPIPRG.2 | DS1307.8 44.6,22.84 44.6,21 | 44.6,21 42.6,19 42.6,13 | DS3231.4 51.63,21.96 51.6,22 50.6,21 | 50.6,21 44.6,21 | DS3231.2 51.11,24.5 | 51.11,24.5 50.6,24 50.6,21 | PUSDA1.2 55.6,34.58 R1.2 | PUSCL1.2 58.6,34.42 R2.2 R1.2 | R1.2 55.02,32.42 52.6,30 51.6,30 51.11,29.5 51.11,24.5

### Text on the board
tDocu: GBO | electrogeek.cc | GBLinkClock / v1.0 - 2024/03 | PWR SEL | USB/Ext | Select | GBA/GBC | VUSB | GB | - | +